# EAGLE design MegaShield-thruhole (EAGLE 8.5.0)
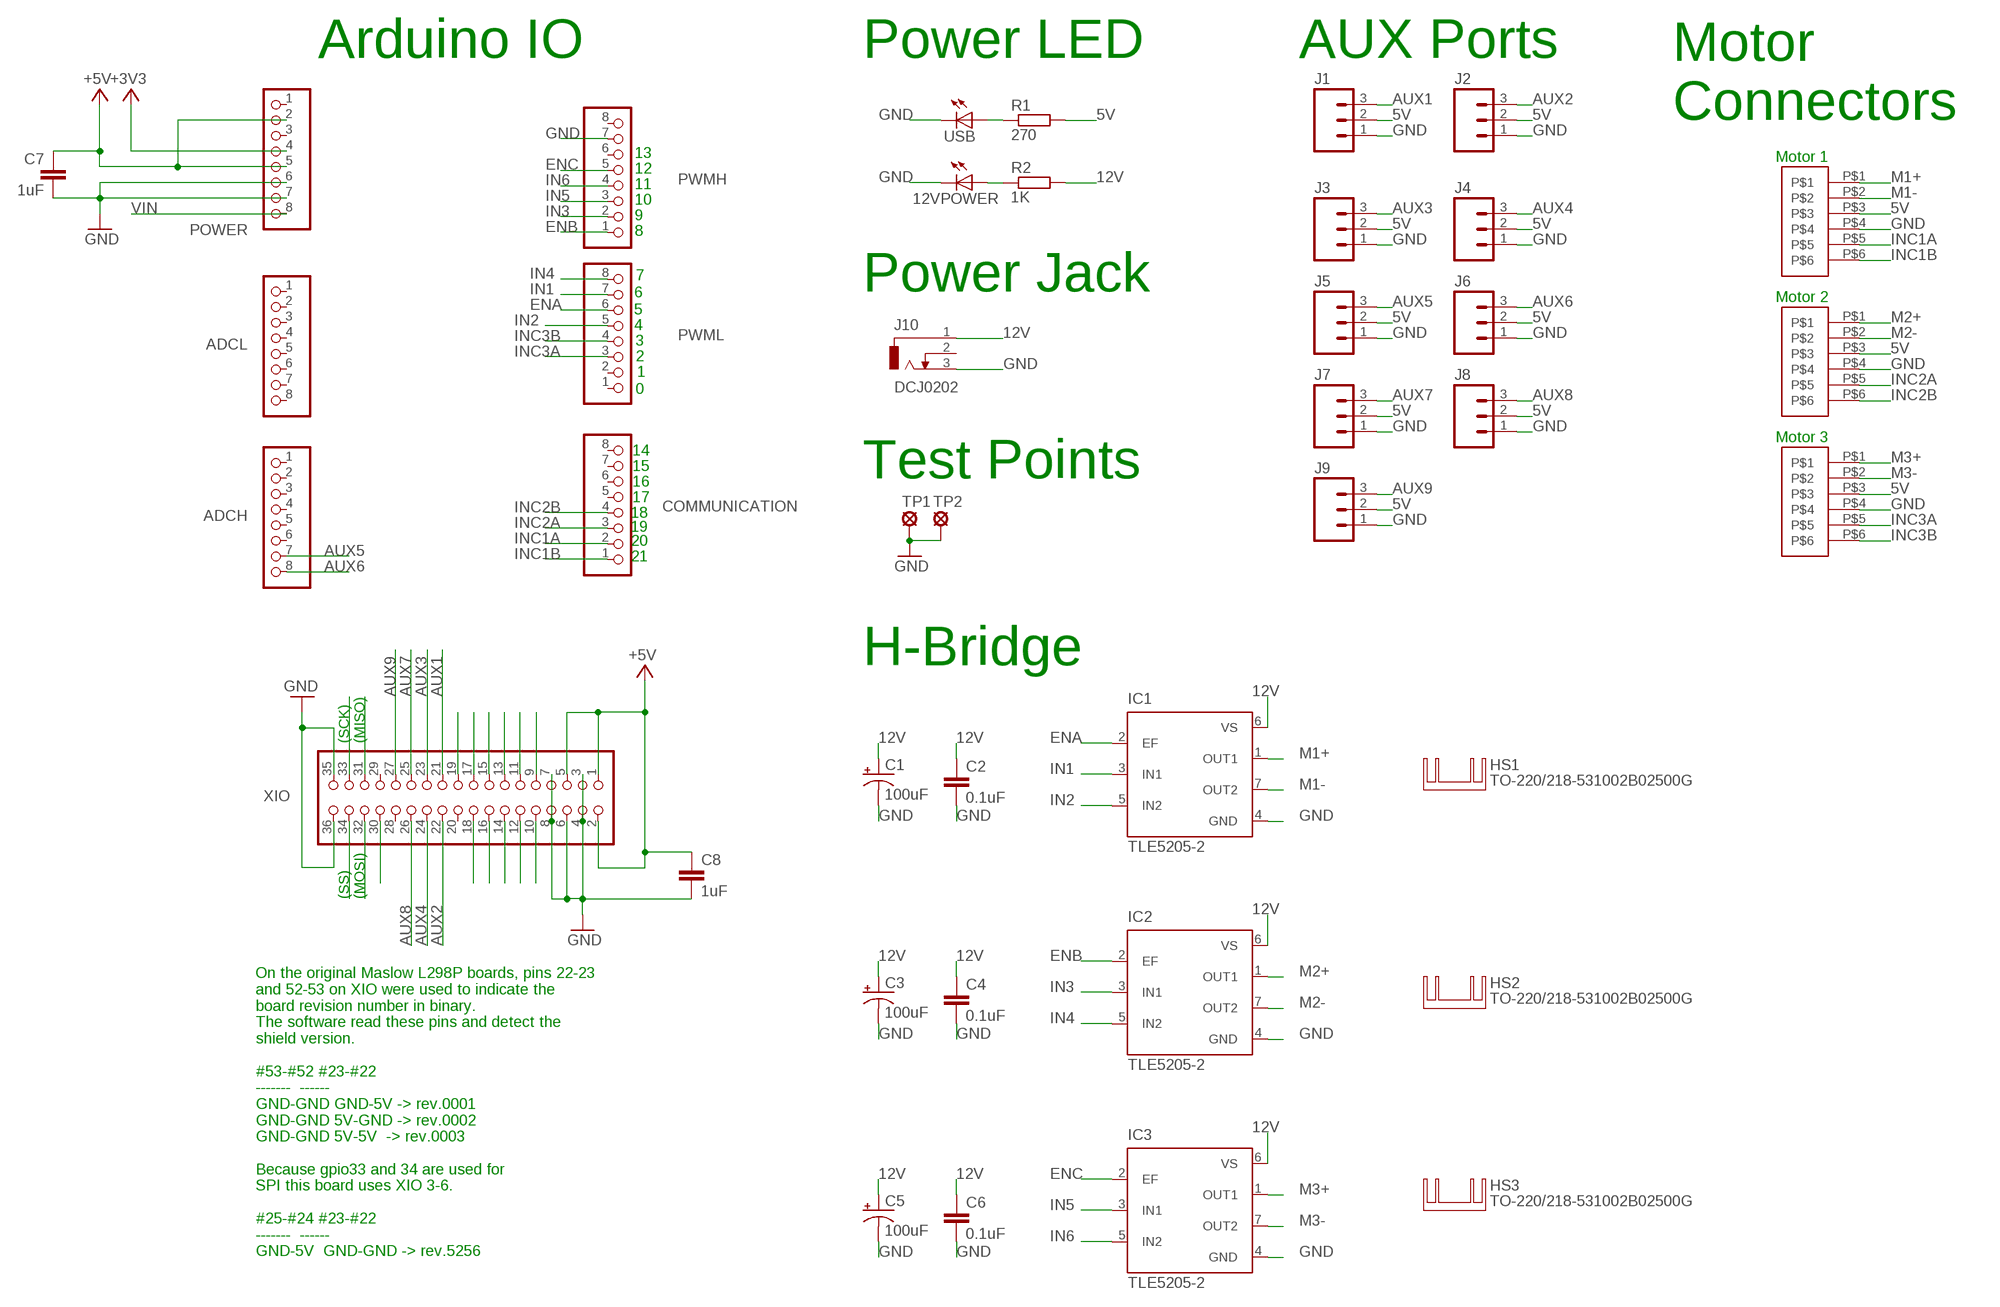
[diagram p0: schematic, sheet 1]

## Parts
12VPOWER  LED_ELD260  [LED_LD260]
ADCH  8x1F-H8.5  PINHD-1X8  [1X08]
ADCL  PINHD-1X8  [1X08]
C1  100uF  CAP_POLPTH1  [CPOL-RADIAL-100UF-25V]
C2  0.1uF  CAPPTH  [CAP-PTH-SMALL]
C3  100uF  CAP_POLPTH1  [CPOL-RADIAL-100UF-25V]
C4  0.1uF  CAPPTH  [CAP-PTH-SMALL]
C5  100uF  CAP_POLPTH1  [CPOL-RADIAL-100UF-25V]
C6  0.1uF  CAPPTH  [CAP-PTH-SMALL]
C7  1uF  CAPPTH  [CAP-PTH-SMALL]
C8  1uF  CAPPTH  [CAP-PTH-SMALL]
COMMUNICATION  PINHD-1X8  [1X08]
HS1  TO-220/218-531002B02500G  TO-220/218-531XXXXXXXX  [531XXXXXXXX]
HS2  TO-220/218-531002B02500G  TO-220/218-531XXXXXXXX  [531XXXXXXXX]
HS3  TO-220/218-531002B02500G  TO-220/218-531XXXXXXXX  [531XXXXXXXX]
IC1  TLE5205-2  [P-TO220-7-11]
IC2  TLE5205-2  [P-TO220-7-11]
IC3  TLE5205-2  [P-TO220-7-11]
J1  M03LOCK  [1X03_LOCK]
J2  M03LOCK  [1X03_LOCK]
J3  M03LOCK  [1X03_LOCK]
J4  M03LOCK  [1X03_LOCK]
J5  M03LOCK  [1X03_LOCK]
J6  M03LOCK  [1X03_LOCK]
J7  M03LOCK  [1X03_LOCK]
J8  M03LOCK  [1X03_LOCK]
J9  M03LOCK  [1X03_LOCK]
J10  DCJ0202  [DCJ0202]
MP1  JST-PH-6  [JST-PHR-6-SMD]
MP2  JST-PH-6  [JST-PHR-6-SMD]
MP3  JST-PH-6  [JST-PHR-6-SMD]
POWER  8x1F-H8.5  PINHD-1X8  [1X08]
PWMH  PINHD-1X8  [1X08]
PWML  PINHD-1X8  [1X08]
R1  270  R0207/10  [0207/10]
R2  1K  R0207/10  [0207/10]
TP1  LSP10  [LSP10]
TP2  LSP10  [LSP10]
USB  LED_ELD260  [LED_LD260]
XIO  18x2F-H8.5  PINHD-2X18  [2X18]

## Nets
5V: C7.1 C8.1 J1.2 J2.2 J3.2 J4.2 J5.2 J6.2 J7.2 J8.2 J9.2 MP1.P$3 MP2.P$3 MP3.P$3 POWER.2 POWER.5 R1.2 XIO.1 XIO.2 XIO.5 ; supply symbol labelled +5V
12V: C1.1(+) C2.1 C3.1(+) C4.1 C5.1(+) C6.1 IC1.6(VS) IC2.6(VS) IC3.6(VS) J10.1 R2.2
+3V3 [power]: POWER.4
AUX1: J1.3 XIO.21
AUX2: J2.3 XIO.22
AUX3: J3.3 XIO.23
AUX4: J4.3 XIO.24
AUX5: ADCH.7 J5.3
AUX6: ADCH.8 J6.3
AUX7: J7.3 XIO.25
AUX8: J8.3 XIO.26
AUX9: J9.3 XIO.27
ENA: IC1.2(EF) PWML.6
ENB: IC2.2(EF) PWMH.1
ENC: IC3.2(EF) PWMH.5
GND [gnd]: 12VPOWER.K(C) C1.2(-) C2.2 C3.2(-) C4.2 C5.2(-) C6.2 C7.2 C8.2 IC1.4(GND) IC2.4(GND) IC3.4(GND) J1.1 J2.1 J3.1 J4.1 J5.1 J6.1 J7.1 J8.1 J9.1 J10.3 MP1.P$4 MP2.P$4 MP3.P$4 POWER.6 POWER.7 PWMH.7 TP1.MP TP2.MP USB.K(C) XIO.3 XIO.4 XIO.6 XIO.7 XIO.8 XIO.35 XIO.36
IN1: IC1.3(IN1) PWML.7
IN2: IC1.5(IN2) PWML.5
IN3: IC2.3(IN1) PWMH.2
IN4: IC2.5(IN2) PWML.8
IN5: IC3.3(IN1) PWMH.3
IN6: IC3.5(IN2) PWMH.4
INC1A: COMMUNICATION.2 MP1.P$5
INC1B: COMMUNICATION.1 MP1.P$6
INC2A: COMMUNICATION.3 MP2.P$5
INC2B: COMMUNICATION.4 MP2.P$6
INC3A: MP3.P$5 PWML.3
INC3B: MP3.P$6 PWML.4
M1+: IC1.1(OUT1) MP1.P$1
M1-: IC1.7(OUT2) MP1.P$2
M2+: IC2.1(OUT1) MP2.P$1
M2-: IC2.7(OUT2) MP2.P$2
M3+: IC3.1(OUT1) MP3.P$1
M3-: IC3.7(OUT2) MP3.P$2
N$2: R1.1 USB.A
N$3: 12VPOWER.A R2.1
PA6: XIO.9
PA7: XIO.10
PB0: XIO.34
PB1: XIO.33
PB2: XIO.32
PB3: XIO.31
PC0: XIO.18
PC1: XIO.17
PC2: XIO.16
PC3: XIO.15
PC4: XIO.14
PC5: XIO.13
PC6: XIO.12
PC7: XIO.11
PD7: XIO.19
PL0: XIO.30
VIN [power]: POWER.8
Unconnected: ADCH.1 ADCH.2 ADCH.3 ADCH.4 ADCH.5 ADCH.6 ADCL.1 ADCL.2 ADCL.3 ADCL.4 ADCL.5 ADCL.6 ADCL.7 ADCL.8 COMMUNICATION.5 COMMUNICATION.6 COMMUNICATION.7 COMMUNICATION.8 J10.2 POWER.1 POWER.3 PWMH.6 PWMH.8 PWML.1 PWML.2 XIO.20 XIO.28 XIO.29

## Notes on the sheet
- Arduino IO | Power LED | AUX Ports
- Motor
  Connectors
- Motor 1
- 13
- 12
- 11
- 10
- 9
- 8
- 7
- Power Jack | Motor 2
- 6
- 5
- 4
- 3
- 2
- 1
- 0
- Motor 3
- 14
- 15
- Test Points
- 16
- 17
- 18
- 19
- 20
- 21
- H-Bridge
- (SCK) | (MISO)
- (SS) | (MOSI)
- On the original Maslow L298P boards, pins 22-23
  and 52-53 on XIO were used to indicate the 
  board revision number in binary. 
  The software read these pins and detect the 
  shield version.
  
  #53-#52 #23-#22
  -------  ------
  GND-GND GND-5V -> rev.0001
  GND-GND 5V-GND -> rev.0002
  GND-GND 5V-5V  -> rev.0003
  
  Because gpio33 and 34 are used for 
  SPI this board uses XIO 3-6.
  
  #25-#24 #23-#22
  -------  ------
  GND-5V  GND-GND -> rev.5256

## Library data of the parts
12VPOWER USB = eagle-ltspice:LED_E: LED Source: http://www.osram.convergy.de Source: www.luxeon.com Source: www.kingbright.com; SPICEMODEL: NONE; SPICEPREFIX: D; SPICETYPE: diode
ADCH POWER = SmartPrj:PINHD-1X8: PIN HEADER
ADCL COMMUNICATION PWMH PWML = pinhead:PINHD-1X8: PIN HEADER
C1 C3 C5 = SparkFun:CAP_POL: Capacitor Polarized These are standard SMD and PTH capacitors. Normally 10uF, 47uF, and 100uF in electrolytic and tantalum varieties. Always verify the external diameter of the through hole cap, it varies with capacity, voltage, and manufacturer. The EIA devices should be standard.
C2 C4 C6-C8 = SparkFun:CAP: Capacitor Standard 0603 ceramic capacitor, and 0.1" leaded capacitor.
HS1-HS3 = heatsink-aavid:TO-220/218: HEATSINKS TO-220/218; DIGIKEY: HS351-ND
IC1 IC2 = infineon:TLE5205-2: 5-A H-Bridge for DC-Motor Applications Source: http://www.infineon.com .. tle5205-2.pdf; OC_FARNELL: unknown; OC_NEWARK: unknown
IC3 = infineon:TLE5205-2: 5-A H-Bridge for DC-Motor Applications Source: http://www.infineon.com .. tle5205-2.pdf; DIGIKEY: TLE5206-2S-ND; OC_FARNELL: unknown; OC_NEWARK: unknown
J1-J9 = SparkFun-Connectors:M03: Header 3 Standard 3-pin 0.1" header. Use with straight break away headers (SKU : PRT-00116), right angle break away headers (PRT-00553), swiss pins (PRT-00743), machine pins (PRT-00117), and female headers (PRT-00115). Molex polarized connector foot print use with SKU : PRT-08232 with associated crimp pins and housings.
J10 = con-jack:DCJ0202: DC POWER JACK Source: DCJ0202.pdf; OC_FARNELL: unknown; OC_NEWARK: unknown
MP1-MP3 = JST-CON:JST-PH-6
R1 R2 = eagle-ltspice:R: RESISTOR, European symbol; SPICEMODEL: NONE; SPICEPREFIX: R
TP1 TP2 = solpad:LSP10: SOLDER PAD drill 1.0 mm, distributor Buerklin, 12H555
XIO = SmartPrj:PINHD-2X18: PIN HEADER

## Net classes
1 power: width 0.61 mm, drill 0.711 mm, clearance 0.203 mm
2 gnd: width 0.305 mm, drill 0.711 mm, clearance 0.203 mm
3 usbvcc: width 0.508 mm, drill 0.711 mm, clearance 0.203 mm

## Board
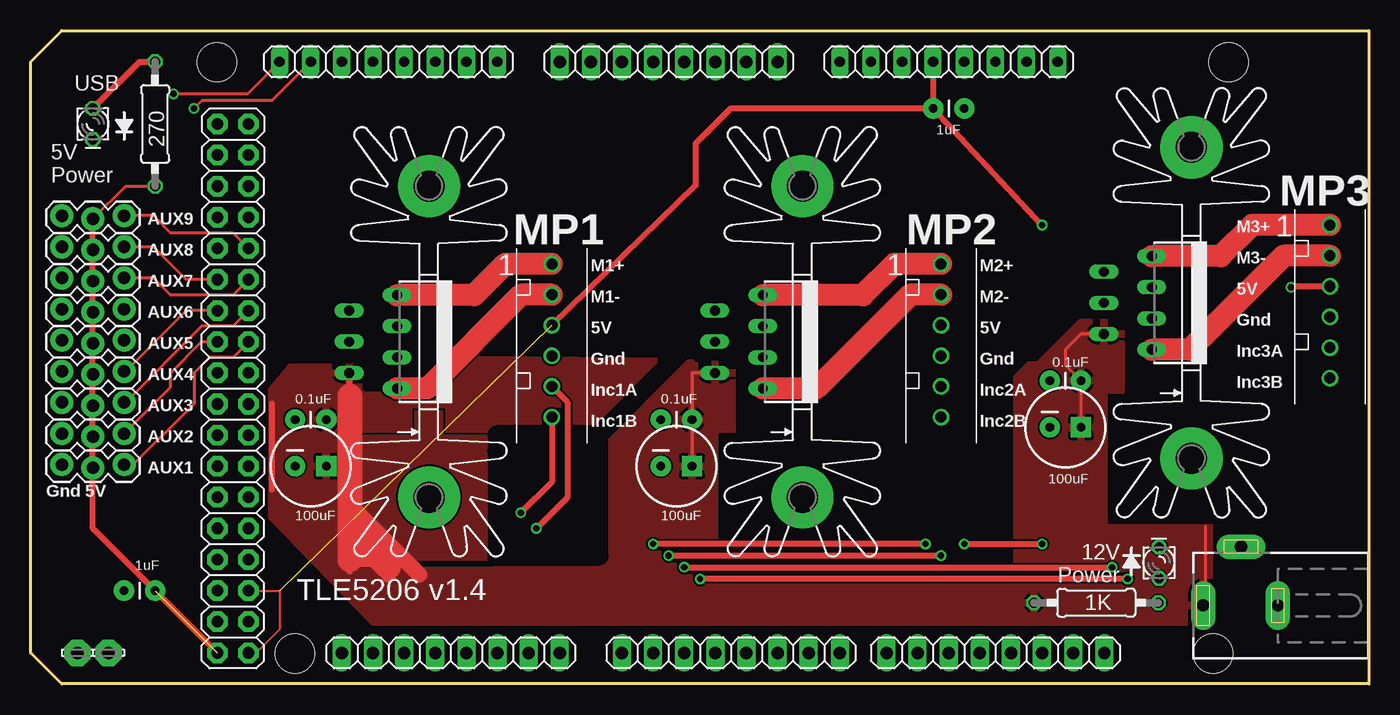
[diagram p1: board, top side]
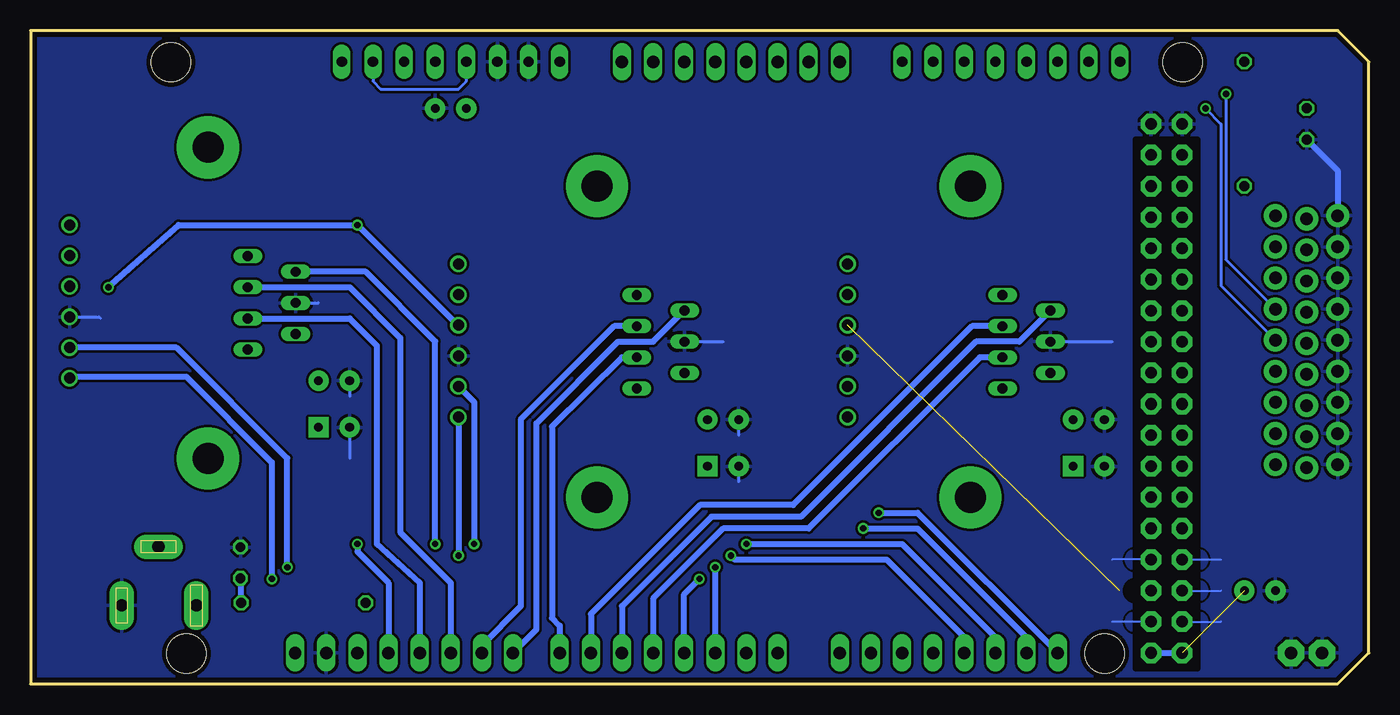
[diagram p2: board, bottom side, seen from below]

Size 109.22 x 53.34 mm. Coordinates in mm from the lower left corner, seen from the top.
Outline: 2.54,0 0,2.54 0,50.8 2.53,53.34 109.22,53.34 109.22,0 2.54,0
Copper layers (1*16): Top 0.0356mm / dielectric 1.5011mm / Bottom 0.0356mm
Design rules "PCBs_io *": minimum track width 6mil, minimum drill 13mil, track to track 6mil, track to pad 6mil, pad to pad 6mil, via to via 6mil, smd to smd 6mil, copper to edge 15mil, drill to drill 6mil, minimum pad ring 7mil, minimum via ring 7mil, stop-mask expansion 3mil, vias tented up to drill 0mil, thermal gap 10mil
Holes 3.2 mm at 15.22,50.76 96.5,2.5 21.57,2.5 97.77,50.76
tRestrict: area 24.8,24.1 to 32.4,27.9; area 55.2,24.1 to 62.9,27.9; area 87,27.9 to 94.6,31.8; area 38.1,10.5 to 46.4,20.3; area 71.1,9.2 to 79.4,25.4; area 13,6.7 to 14.9,8.6; area 13,4.1 to 14.9,6; area 18.1,4.1 to 20,6; area 18.1,6.7 to 20,8.6; area 13,9.2 to 14.9,11.1; area 18.1,9.2 to 20,11.1; 17 lines
bRestrict: area 14,1.3 to 19.1,44.5; area 13,9.2 to 14.9,11.1; area 18.1,9.2 to 20,11.1; area 18.1,6.7 to 20,8.6; area 18.1,4.1 to 20,6; area 13,4.1 to 14.9,6; area 13,6.7 to 14.9,8.6

### Footprints (pad centres in the part's own frame; a part is rotated, then mirrored left to right if it is on the bottom)
LED_LD260 = drill 0.813 octagon: A -1.27,0; K 1.27,0
1X08 = drill 0.85 pad 1.422 long: 1 -8.89,0; 2 -6.35,0; 3 -3.81,0; 4 -1.27,0; 5 1.27,0; 6 3.81,0; 7 6.35,0; 8 8.89,0
1X08' = drill 1.016 long: 1 -8.89,0; 2 -6.35,0; 3 -3.81,0; 4 -1.27,0; 5 1.27,0; 6 3.81,0; 7 6.35,0; 8 8.89,0
CPOL-RADIAL-100UF-25V = drill 0.7 pad 1.651 square: 1 1.27,0 | drill 0.7 pad 1.651: 2 -1.27,0
CAP-PTH-SMALL = drill 0.7 pad 1.651: 1 0,0; 2 2.54,0
531XXXXXXXX = drill 2.54 pad 5.08: A2,5 -12.7,-0.762; B2,5 12.7,-0.762
P-TO220-7-11 = drill 0.8 pad 1.2 long: 1 -3.81,-1.85; 2 -2.54,-5.75; 3 -1.27,-1.85; 4 0,-5.75; 5 1.27,-1.85; 6 2.54,-5.75; 7 3.81,-1.85
1X03_LOCK = drill 1.016 pad 1.88: 1 0,0.127; 2 2.54,-0.127; 3 5.08,0.127
DCJ0202 = drill 1 pad 2 long: 1 0,3.1; 2 4.8,0; 3 0,-3
JST-PHR-6-SMD = drill 0.9: P$1 0,0; P$2 2.5,0; P$3 5,0; P$4 7.5,0; P$5 10,0; P$6 12.5,0
0207/10 = drill 0.813 octagon: 1 -5.08,0; 2 5.08,0
LSP10 = drill 1.016 pad 2.159 octagon: MP 0,0
2X18 = drill 0.95 pad 1.676 octagon: 1 -21.59,-1.27; 2 -21.59,1.27; 3 -19.05,-1.27; 4 -19.05,1.27; 5 -16.51,-1.27; 6 -16.51,1.27; 7 -13.97,-1.27; 8 -13.97,1.27; 9 -11.43,-1.27; 10 -11.43,1.27; 11 -8.89,-1.27; 12 -8.89,1.27; 13 -6.35,-1.27; 14 -6.35,1.27; 15 -3.81,-1.27; 16 -3.81,1.27; 17 -1.27,-1.27; 18 -1.27,1.27; 19 1.27,-1.27; 20 1.27,1.27; 21 3.81,-1.27; 22 3.81,1.27; 23 6.35,-1.27; 24 6.35,1.27; 25 8.89,-1.27; 26 8.89,1.27; 27 11.43,-1.27; 28 11.43,1.27; 29 13.97,-1.27; 30 13.97,1.27; 31 16.51,-1.27; 32 16.51,1.27; 33 19.05,-1.27; 34 19.05,1.27; 35 21.59,-1.27; 36 21.59,1.27

### Placement (x,y rotation side)
12VPOWER  92.1,9.9 90 top
ADCH  29.21,50.8 180 top
ADCL  [1X08']  52.07,50.8 0 top
C1  22.86,17.78 0 top
C2  24.13,21.59 180 top
C3  52.7,17.78 0 top
C4  53.98,21.59 180 top
C5  84.45,20.95 0 top
C6  85.72,24.77 180 top
C7  10.16,7.62 180 top
C8  73.66,46.99 0 top
COMMUNICATION  [1X08']  34.29,2.54 0 top
HS1  31.75,27.94 90 top
HS2  62.23,27.94 90 top
HS3  93.98,31.11 90 top
IC1  31.75,27.94 270 top
IC2  61.59,27.94 270 top
IC3  93.34,31.11 270 top
J1  2.54,17.78 0 top
J2  2.54,20.32 0 top
J3  2.54,22.86 0 top
J4  2.54,25.4 0 top
J5  2.54,27.94 0 top
J6  2.54,30.48 0 top
J7  2.54,33.02 0 top
J8  2.54,35.56 0 top
J9  2.54,38.1 0 top
J10  98.79,6.41 90 top
MP1  42.55,34.29 270 top
MP2  74.3,34.29 270 top
MP3  106.05,37.47 270 top
POWER  74.93,50.8 180 top
PWMH  [1X08']  78.74,2.54 0 top
PWML  [1X08']  57.15,2.54 0 top
R1  10.16,45.72 270 top
R2  86.97,6.63 180 top
TP1  3.81,2.54 0 top
TP2  6.35,2.54 0 top
USB  5.08,45.72 270 top
XIO  16.51,24.13 90 top

### Tracks (layer width: path | path; a pad name or v marks a point on that pad's centre or on a via)
5V  (via drill 0.51)  (2 unrouted)
  Top 0.152: XIO.5 20.32,7.62 20.32,4.45 18.41,2.54 XIO.1
  Top 0.254: J9.2 7.75,40.64 R1.2
  Top 0.508: C8.1 57.15,46.99 54.29,44.13 54.29,40.72 MP1.P$3 | C8.1 v82.55,37.47 | MP3.P$3 102.95,32.47 v102.87,32.38 | POWER.5 C8.1 | XIO.2 5.08,12.7 J1.2 J2.2 J3.2 J4.2 J5.2 J6.2 J7.2 J8.2 J9.2
  Bottom 0.254: POWER.2 81.28,49.21 80.64,48.58 74.3,48.58 73.66,49.21 POWER.5
  Bottom 0.508: v102.87,32.38 97.16,37.47 v82.55,37.47 74.38,29.29 MP2.P$3 | XIO.1 XIO.2
12V
  Top 0.254: IC2.6 53.98,25.4 C4.1 C3.1 | IC3.6 85.72,28.57 84.45,27.3 84.45,26.04 C6.1 C5.1 | 95.89,12.9 95.89,6.61 J10.1
  Top 0.508: 25.4,12.7 25.41,12.69 25.41,9.8 26.04,9.17 | IC1.6 26,23.53 26.04,23.5 | 19.68,22.86 19.68,15.88
  Top 1.27: 31.75,8.89 30.48,10.16 | 30.48,10.16 26.67,10.16 | 30.48,10.16 26.04,14.61 26.04,15.24 | 29.21,9.53 29.21,8.89
  Top 2.032: 26.04,23.5 26.04,15.24 26.04,12.7 | 26.04,12.7 26.04,10.16 | 26.04,12.7 29.21,9.53
  pour Top: 19.68,26.67 82.23,26.04 85.72,29.53 96.2,29.53 96.2,5.08 27.94,5.08 19.68,13.65
AUX1
  Top 0.254: XIO.21 16.51,26.67 14.61,26.67 13.34,25.4 13.34,22.86 8.38,17.91 J1.3
AUX2
  Top 0.254: J2.3 11.43,24.26 11.43,25.4 13.97,27.94 XIO.22
AUX3
  Top 0.254: XIO.23 16.51,29.21 13.97,29.21 7.62,22.86 J3.3
AUX4
  Top 0.254: XIO.24 12.7,30.48 7.62,25.4 J4.3
AUX5  (via drill 0.51)
  Top 0.254: ADCH.7 19.68,47.62 13.97,47.62 v13.34,46.99
  Bottom 0.254: v13.34,46.99 12.06,45.72 12.06,32.51 J5.3
AUX6  (via drill 0.51)
  Top 0.254: v11.66,48.18 17.7,48.18 ADCH.8
  Bottom 0.254: J6.3 11.66,34.65 v11.66,48.18
AUX7
  Top 0.254: XIO.25 16.51,31.75 11.43,31.75 10.03,33.15 J7.3
AUX8
  Top 0.254: XIO.26 12.7,33.02 10.03,35.69 J8.3
AUX9
  Top 0.254: XIO.27 16.51,36.83 11.43,36.83 10.03,38.23 J9.3
ENA
  Bottom 0.508: IC1.2 28.54,27.94 32.07,27.94 46.35,13.65 53.66,13.65 60.96,6.35 PWML.6
ENB
  Bottom 0.508: PWMH.1 67.94,4.45 67.94,21.27 61.28,27.94 58.42,27.94 55.88,30.48 IC2.2
ENC  (via drill 0.51)
  Top 0.508: v76.2,11.43 v82.55,11.43
  Bottom 0.508: v76.2,11.43 76.2,27.98 81.88,33.66 IC3.2 | v82.55,11.43 82.55,10.79 80.01,8.26 PWMH.5
GND
  Bottom 0.152: XIO.4 12.06,5.08 | XIO.3 20.95,5.08 | XIO.6 12.06,7.62 | XIO.8 12.06,10.16 | XIO.7 20.95,10.16
  Bottom 0.254: IC2.4 52.7,27.94 | IC1.4 20.95,27.94 | C4.2 51.44,20.32 | C3.2 51.44,16.51 | C6.2 83.19,23.5 | C5.2 83.19,18.41 | MP3.P$4 103.62,29.96 103.5,29.84 | IC3.4 85.72,31.11
  Bottom 0.508: USB.K 2.54,41.91 J9.1
  pour Bottom: 2.54,53.34 109.22,53.34 109.22,0 2.54,0 0,2.54 0,50.8
IN1
  Bottom 0.508: IC1.3 32.38,29.21 46.99,14.61 54.61,14.61 63.5,5.71 PWML.7
IN2
  Bottom 0.508: IC1.5 31.75,26.67 45.72,12.7 52.7,12.7 58.42,6.99 PWML.5
IN3
  Bottom 0.508: IC2.3 61.59,29.21 69.22,21.59 69.22,6.35 72.39,3.17 PWMH.2
IN4
  Bottom 0.508: IC2.5 60.96,26.67 66.67,21.01 66.67,5.4 66.04,4.76 PWML.8
IN5
  Bottom 0.508: IC3.3 83.19,32.38 79.06,28.26 79.06,12.38 74.93,8.26 PWMH.3
IN6
  Bottom 0.508: IC3.5 83.19,29.84 80.96,27.62 80.96,11.43 77.47,8.26 PWMH.4
INC1A  (via drill 0.51)
  Top 0.508: MP1.P$5 43.81,23.02 43.81,15.24 v41.27,12.7
  Bottom 0.508: v41.27,12.7 36.83,12.7 27.94,3.81 COMMUNICATION.2
INC1B  (via drill 0.51)
  Top 0.508: MP1.P$6 42.55,16.51 v40.01,13.97
  Bottom 0.508: v40.01,13.97 36.83,13.97 COMMUNICATION.1
INC2A  (via drill 0.51)
  Top 0.508: v73.03,11.43 v50.8,11.43
  Bottom 0.508: MP2.P$5 73.03,23.02 v73.03,11.43 | v50.8,11.43 38.1,11.43 30.48,3.81 COMMUNICATION.3
INC2B  (via drill 0.51)
  Top 0.508: v74.3,10.48 v52.07,10.48
  Bottom 0.508: MP2.P$6 v74.3,10.48 | v52.07,10.48 51.75,10.16 39.37,10.16 33.02,3.81 COMMUNICATION.4
INC3A  (via drill 0.51)
  Top 0.508: v53.34,9.53 v88.27,9.53
  Bottom 0.508: PWML.3 v53.34,9.53 | v88.27,9.53 88.27,18.41 97.31,27.46 MP3.P$5
INC3B  (via drill 0.51)
  Top 0.508: v89.53,8.57 v54.64,8.57
  Bottom 0.508: MP3.P$6 105.93,25.08 96.52,25.08 89.53,18.1 v89.53,8.57 | PWML.4 55.88,7.33 v54.64,8.57
M1+
  Top 1.778: MP1.P$1 38.73,34.29 36.2,31.75 IC1.1
M1-
  Top 1.778: MP1.P$2 40.05,31.79 32.38,24.13 IC1.7
M2+
  Top 1.778: MP2.P$1 70.48,34.29 67.94,31.75 IC2.1
M2-
  Top 1.778: MP2.P$2 71.8,31.79 64.14,24.13 IC2.7
M3+
  Top 1.778: MP3.P$1 99.69,37.47 97.16,34.92 IC3.1
M3-
  Top 1.778: MP3.P$2 102.28,34.97 94.61,27.3 IC3.7
N$2
  Top 0.508: USB.A 8.89,50.8 R1.1
N$3
  Bottom 0.508: 12VPOWER.A 92.1,6.68 R2.1

### Text on the board
tPlace: 5V / Power | MP3 | AUX9 | M3+ | 1 | MP1 | MP2 | AUX8 | M1+ | M2+ | M3- | 1 | 1 | AUX7 | 5V | M1- | M2- | AUX6 | 5V | 5V | Gnd | AUX5 | Inc3A | Gnd | Gnd | AUX4 | Inc3B | Inc1A | Inc2A | AUX3 | Inc1B | Inc2B | AUX2 | AUX1 | Gnd | 5V | 12V / Power | TLE5206 v1.4